# Altium schematic sheet Sheet2 (2).SchDoc
size 420 x 297 mm; Address1: Address1; Address2: Address2; Address3: Address3; Address4: Address4; DocumentNumber: АБВГ.123456.001 Э3; SheetNumber: 2; SheetTotal: 2; Scale: 1:1; DocumentType: Схема электрическая принципиальная; FirstReferrence: АБВГ.123456.001
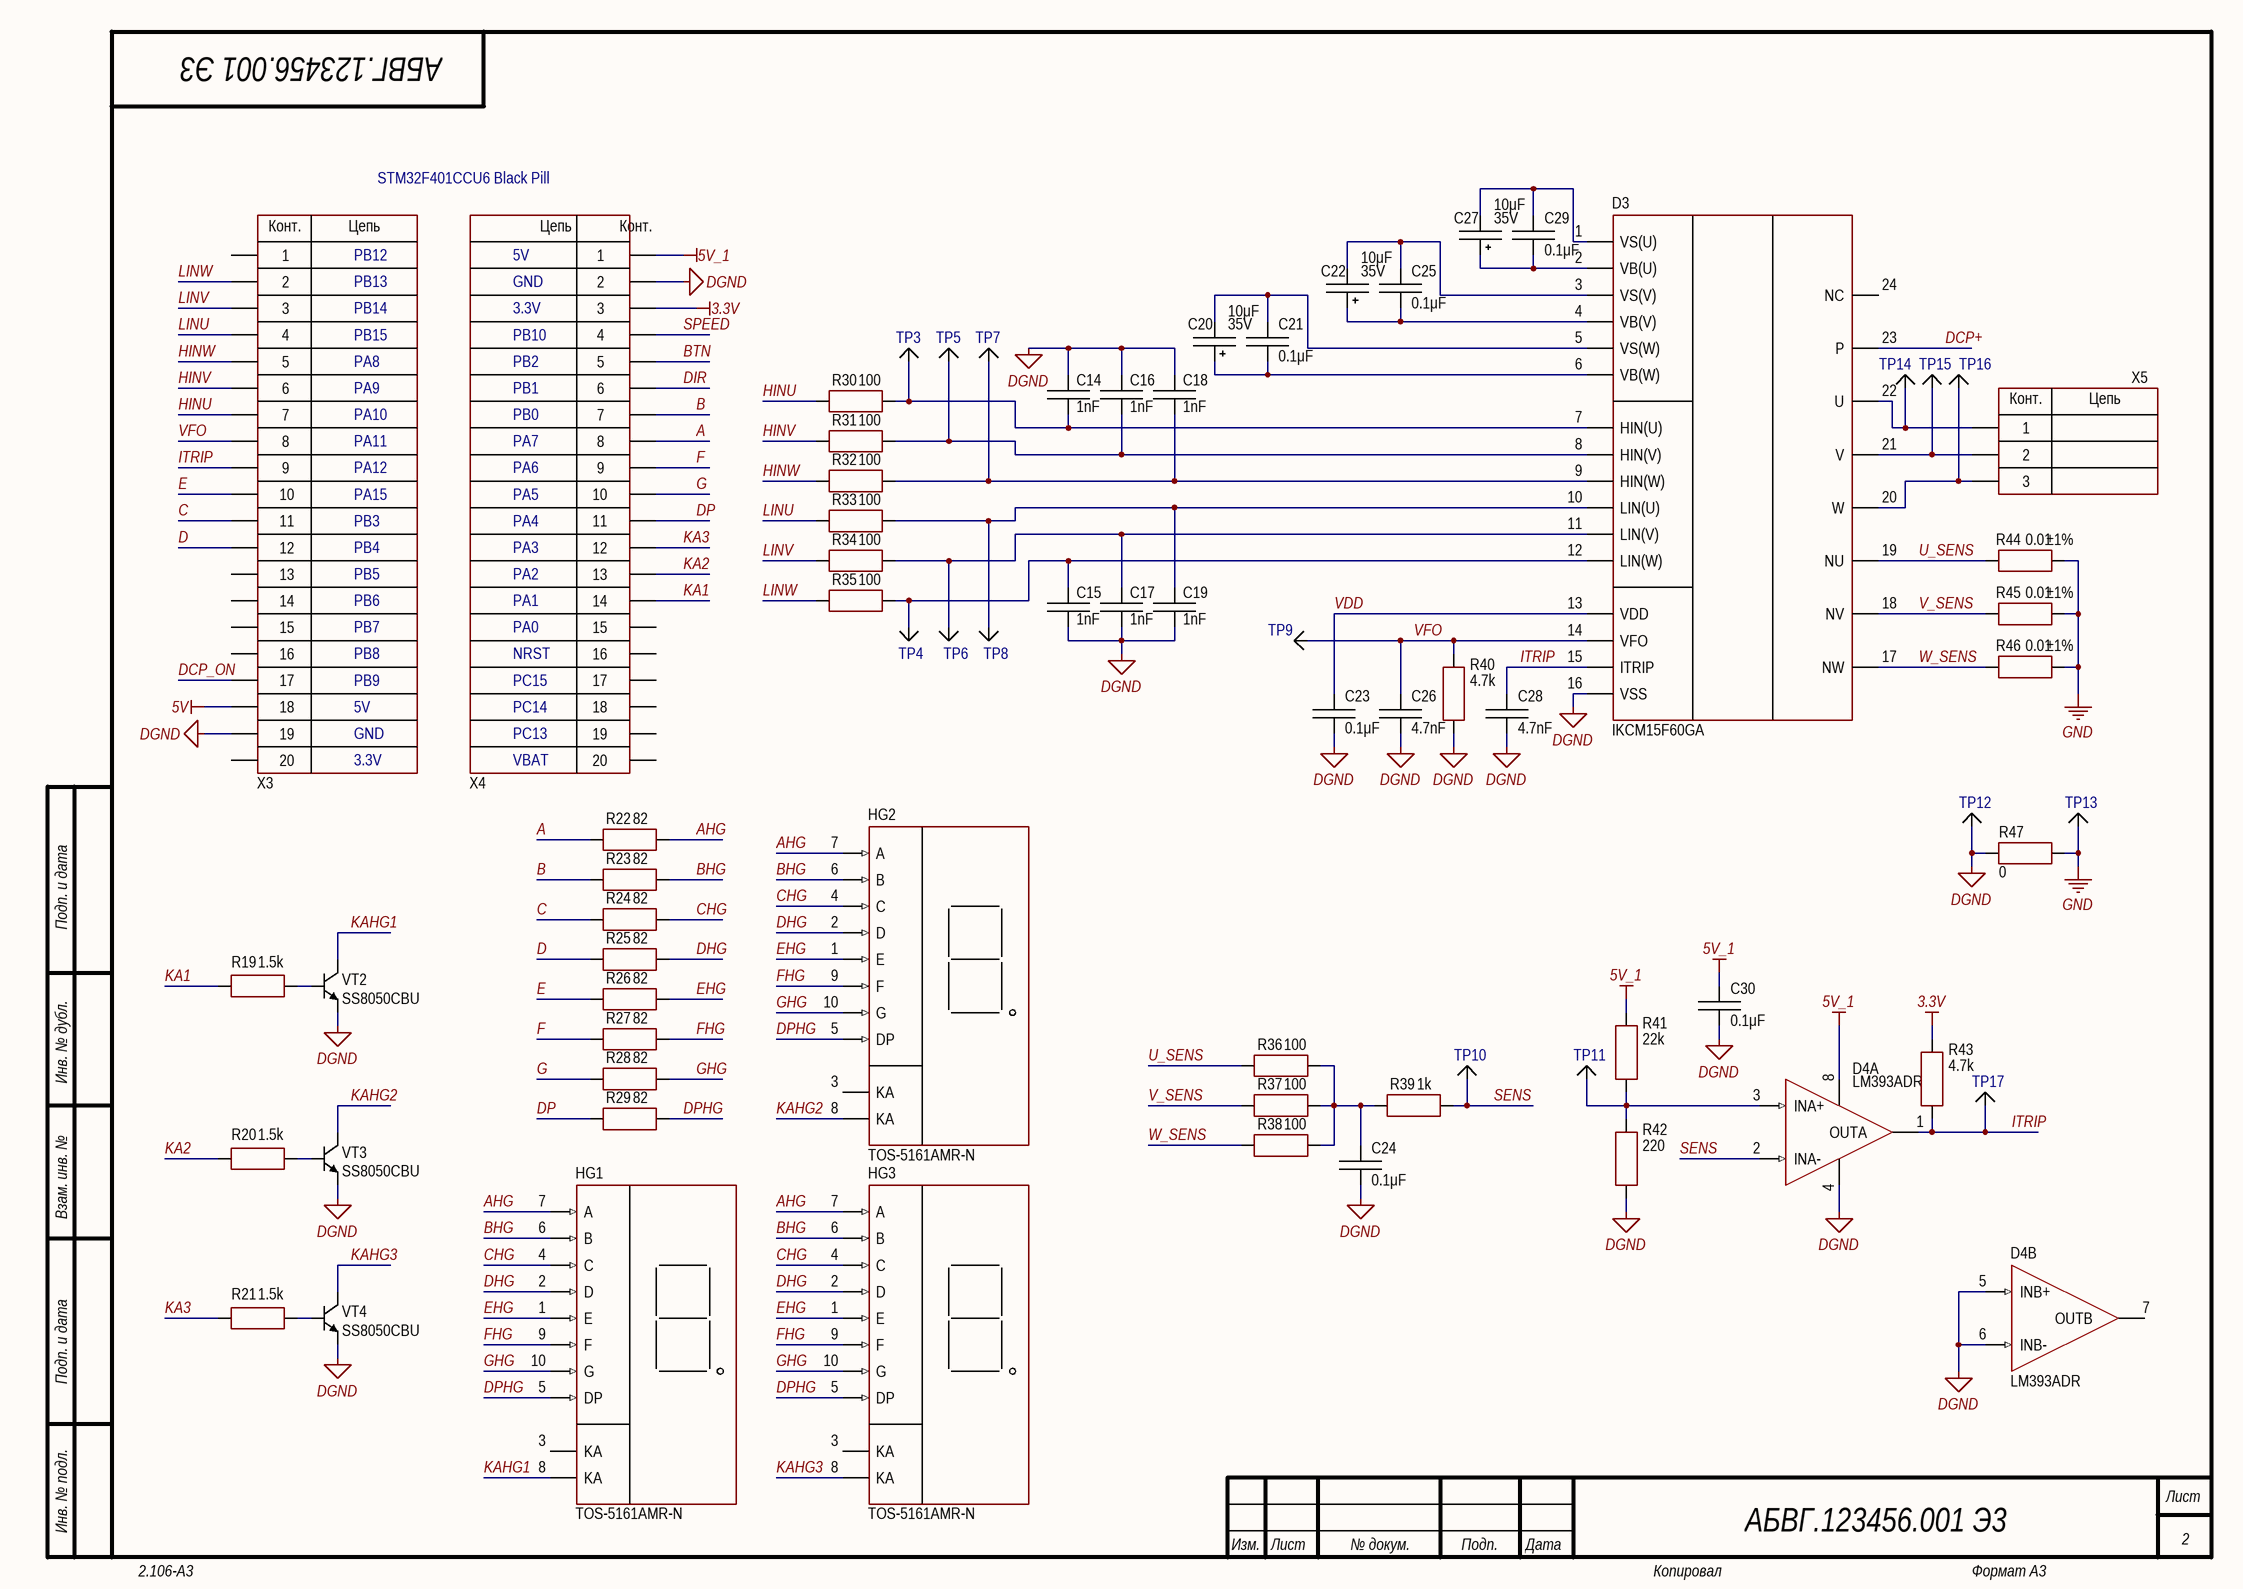
[diagram p0: Sheet2 (2).SchDoc]

## Parts
C14  value 1nF  [CAP: 1206]
C15  value 1nF  [CAP: 1206]
C16  value 1nF  [CAP: 1206]
C17  value 1nF  [CAP: 1206]
C18  value 1nF  [CAP: 1206]
C19  value 1nF  [CAP: 1206]
C20  value 10μF  Voltage: 35V  [CAP: D5C2H11]
C21  value 0.1μF  [CAP: 1206]
C22  value 10μF  Voltage: 35V  [CAP: D5C2H11]
C23  value 0.1μF  [CAP: 1206]
C24  value 0.1μF  [CAP: 1206]
C25  value 0.1μF  [CAP: 1206]
C26  value 4.7nF  [CAP: 1206]
C27  value 10μF  Voltage: 35V  [CAP: D5C2H11]
C28  value 4.7nF  [CAP: 1206]
C29  value 0.1μF  [CAP: 1206]
C30  value 0.1μF  [CAP: 1206]
D3  (no value)  [INF-CIPOS MINI]
D4  (no value)  [8-SOIC]  (parts A,B of 2)
HG1  (no value)  [TOS-5161AMR-N]
HG2  (no value)  [TOS-5161AMR-N]
HG3  (no value)  [TOS-5161AMR-N]
R19  value 1.5k  [RES: 1206]
R20  value 1.5k  [RES: 1206]
R21  value 1.5k  [RES: 1206]
R22  value 82  [RES: 1206]
R23  value 82  [RES: 1206]
R24  value 82  [RES: 1206]
R25  value 82  [RES: 1206]
R26  value 82  [RES: 1206]
R27  value 82  [RES: 1206]
R28  value 82  [RES: 1206]
R29  value 82  [RES: 1206]
R30  value 100  [RES: 1206]
R31  value 100  [RES: 1206]
R32  value 100  [RES: 1206]
R33  value 100  [RES: 1206]
R34  value 100  [RES: 1206]
R35  value 100  [RES: 1206]
R36  value 100  [RES: 1206]
R37  value 100  [RES: 1206]
R38  value 100  [RES: 1206]
R39  value 1k  [RES: 1206]
R40  value 4.7k  [RES: 1206]
R41  value 22k  [RES: 1206]
R42  value 220  [RES: 1206]
R43  value 4.7k  [RES: 1206]
R44  value 0.01  Tolerance: ±1%  [RES: 2512]
R45  value 0.01  Tolerance: ±1%  [RES: 2512]
R46  value 0.01  Tolerance: ±1%  [RES: 2512]
R47  value 0  [RES: 1206]
TP3  Test_Point  [TEST POINT KEYSTONE]  (value not drawn)
TP4  Test_Point  [TEST POINT KEYSTONE]  (value not drawn)
TP5  Test_Point  [TEST POINT KEYSTONE]  (value not drawn)
TP6  Test_Point  [TEST POINT KEYSTONE]  (value not drawn)
TP7  Test_Point  [TEST POINT KEYSTONE]  (value not drawn)
TP8  Test_Point  [TEST POINT KEYSTONE]  (value not drawn)
TP9  Test_Point  [TEST POINT KEYSTONE]  (value not drawn)
TP10  Test_Point  [TEST POINT KEYSTONE]  (value not drawn)
TP11  Test_Point  [TEST POINT KEYSTONE]  (value not drawn)
TP12  Test_Point  [TEST POINT KEYSTONE]  (value not drawn)
TP13  Test_Point  [TEST POINT KEYSTONE]  (value not drawn)
TP14  Test_Point  [TEST POINT KEYSTONE]  (value not drawn)
TP15  Test_Point  [TEST POINT KEYSTONE]  (value not drawn)
TP16  Test_Point  [TEST POINT KEYSTONE]  (value not drawn)
TP17  Test_Point  [TEST POINT KEYSTONE]  (value not drawn)
VT2  (no value)  [TO-92 - formed leads]
VT3  (no value)  [TO-92 - formed leads]
VT4  (no value)  [TO-92 - formed leads]
X3  (no value)  [PBS-20 narrow pitch]
X4  (no value)  [PBS-20 narrow pitch]
X5  (no value)  [DG128-7.5-03P]

## Nets
3.3V: R43.2 X4.3
5V: X3.18
5V_1: C30.2 D4.8(V+) R41.2 X4.1
DGND: C14.2 C15.1 C16.2 C17.1 C18.2 C19.1 C23.1 C24.1 C26.1 C28.1 C30.1 D3.16(VSS) D4.4(GND) D4.5(INB+) D4.6(INB-) R40.1 R42.1 R47.2 TP12.1 VT2.1(E) VT3.1(E) VT4.1(E) X3.19 X4.2
GND: R44.2 R45.2 R46.2 R47.1 TP13.1
A: R22.1 X4.8
AHG: HG1.7(A) HG2.7(A) HG3.7(A) R22.2
B: R23.1 X4.7
BHG: HG1.6(B) HG2.6(B) HG3.6(B) R23.2
BTN: X4.5
C: R24.1 X3.11
CHG: HG1.4(C) HG2.4(C) HG3.4(C) R24.2
D: R25.1 X3.12
DCP+: D3.23(P)
DCP_ON: X3.17
DHG: HG1.2(D) HG2.2(D) HG3.2(D) R25.2
DIR: X4.6
DP: R29.1 X4.11
DPHG: HG1.5(DP) HG2.5(DP) HG3.5(DP) R29.2
E: R26.1 X3.10
EHG: HG1.1(E) HG2.1(E) HG3.1(E) R26.2
F: R27.1 X4.9
FHG: HG1.9(F) HG2.9(F) HG3.9(F) R27.2
G: R28.1 X4.10
GHG: HG1.10(G) HG2.10(G) HG3.10(G) R28.2
HINU: R30.1 X3.7
HINV: R31.1 X3.6
HINW: R32.1 X3.5
ITRIP: C28.2 D3.15(ITRIP) D4.1(OUTA) R43.1 TP17.1 X3.9
KA1: R19.1 X4.14
KA2: R20.1 X4.13
KA3: R21.1 X4.12
KAHG1: HG1.8(KA) VT2.3(C)
KAHG2: HG2.8(KA) VT3.3(C)
KAHG3: HG3.8(KA) VT4.3(C)
LINU: R33.1 X3.4
LINV: R34.1 X3.3
LINW: R35.1 X3.2
SENS: D4.2(INA-) R39.2 TP10.1
SPEED: X4.4
U_SENS: D3.19(NU) R36.1 R44.1
V_SENS: D3.18(NV) R37.1 R45.1
VDD: C23.2 D3.13(VDD)
VFO: C26.2 D3.14(VFO) R40.2 TP9.1 X3.8
W_SENS: D3.17(NW) R38.1 R46.1
NetC14_1: C14.1 D3.7(HIN(U)) R30.2 TP3.1
NetC15_2: C15.2 D3.12(LIN(W)) R35.2 TP4.1
NetC16_1: C16.1 D3.8(HIN(V)) R31.2 TP5.1
NetC17_2: C17.2 D3.11(LIN(V)) R34.2 TP6.1
NetC18_1: C18.1 D3.9(HIN(W)) R32.2 TP7.1
NetC19_2: C19.2 D3.10(LIN(U)) R33.2 TP8.1
NetC20_1: C20.1 C21.1 D3.6(VB(W))
NetC20_2: C20.2 C21.2 D3.5(VS(W))
NetC22_1: C22.1 C25.1 D3.4(VB(V))
NetC22_2: C22.2 C25.2 D3.3(VS(V))
NetC24_2: C24.2 R36.2 R37.2 R38.2 R39.1
NetC27_1: C27.1 C29.1 D3.2(VB(U))
NetC27_2: C27.2 C29.2 D3.1(VS(U))
NetD3_20: D3.20(W) TP16.1 X5.3
NetD3_21: D3.21(V) TP15.1 X5.2
NetD3_22: D3.22(U) TP14.1 X5.1
NetD4_3: D4.3(INA+) R41.1 R42.2 TP11.1
NetR19_2: R19.2 VT2.2(B)
NetR20_2: R20.2 VT3.2(B)
NetR21_2: R21.2 VT4.2(B)

Not connected (* = marked no-connect by the designer): D3 24(NC); D4 7(OUTB); HG1 3(KA); HG2 3(KA); HG3 3(KA); X3 1 13 14 15 16 20; X4 15 16 17 18 19 20

## Notes on the sheet
- STM32F401CCU6 Black Pill
- PB12
- 5V
- PB13
- PB14
- GND
- 3.3V
- PB15
- PA8
- PA9
- PB10
- PB2
- PB1
- PA10
- PA11
- PB0
- PA7
- PA12
- PA15
- PB3
- PA6
- PA5
- PA4
- PB4
- PB5
- PA3
- PA2
- PB6
- PB7
- PB8
- PA1
- PA0
- NRST
- PB9
- PC15
- PC14
- PC13
- VBAT
- Подп. и дата
- Инв. № дубл.
- Взам. инв. №
- Инв. № подл.
- Изм.
- Лист
- № докум.
- Подп.
- Дата
- 2.106-A3
- Копировал
- Формат А3
- (in symbol DG128-7.5-03P-14) Конт.; Цепь
- (in symbol PBS-20) Конт.; Цепь

## Library data of the parts
C14-C19 = Ceramic_1206: PartNumber: Ceramic capacitor, 1nF,   50V; ValueManufacturerPartNumber: Ceramic capacitor, 1nF, X7R, ±10%, 50V, 1206, -55...+125°C; TypeCapacitor: Ceramic capacitor; Tolerance: ±10%; TypeDielectric: X7R; Voltage: 50V; Manufacturer: *; Package: 1206; HelpURL: https://www.chipdip.ru/product0/9000028006; Temperature: -55...+125°C; Price ChipDip: 8
C20 C22 C27 = Aluminium: PartNumber: 9000565842; ValueManufacturerPartNumber: Aluminium capacitor, 10μF, 35V, ±20%, 54mOhm, ?, -40...+105°C; TypeCapacitor: Aluminium capacitor; Tolerance: ±20%; Impedance: 54mOhm; Manufacturer: ?; Package: ?; HelpURL: https://www.chipdip.ru/product0/9000565850; Temperature: -40...+105°C; Price ChipDip: 9
C21 C23-C25 C29 C30 = Ceramic_1206: PartNumber: Ceramic capacitor, 0.1μF,   50V; ValueManufacturerPartNumber: Ceramic capacitor, 0.1μF, X7R, ±10%, 50V, 1206, -55...+125°C; TypeCapacitor: Ceramic capacitor; Tolerance: ±10%; TypeDielectric: X7R; Voltage: 50V; Manufacturer: *; Package: 1206; HelpURL: https://www.chipdip.ru/product0/42211; Temperature: -55...+125°C; Price ChipDip: 11
C26 C28 = Ceramic_1206: PartNumber: Ceramic capacitor, 4.7nF,   50V; ValueManufacturerPartNumber: Ceramic capacitor, 4.7nF, X7R, ±10%, 50V, 1206, -55...+125°C; TypeCapacitor: Ceramic capacitor; Tolerance: ±10%; TypeDielectric: X7R; Voltage: 50V; Manufacturer: *; Package: 1206; HelpURL: https://www.chipdip.ru/product0/470810702; Temperature: -55...+125°C; Price ChipDip: 16
D3 = IKCM15F60GA: Fully isolated Dual In-Line molded  IGBT module; Manufacturer: INFINEON TECHNOLOGIES AG.; VoltageSupply: 450V; CurrentOutput: 15A; HelpURL: https://www.infineon.com/cms/en/product/power/intelligent-power-modules-ipm/ikcm15f60ga/; Package: IKCM15F60GA; ComponentType: 600 V, 15 A three-phase intelligent power module; ValueManufacturerPartNumber: =ComponentType+', '+VoltageWork+', '+Frequency+', '+CurrentOutput+', '+CMTI+', '+VoltageSupply+', '+Temperature+', '+Package; Temperature: -40...+125°C; Price ChipDip: 3120; Price Ali: 700; PartNumber: IKCM15F60GA
D4 = LM393ADR: Low Power Low Offset Voltage Dual Comparator; Manufacturer: UTD Semiconductor Co.,Ltd; ValueManufacturerPartNumber: IC comparator, Rail-to-Rail, 2...36 V, ±1...±18 V, 0…70°C, SOP-8; Supply: 2...36 V, ±1...±18 V; OutputType: Rail-to-Rail; Propagation Delay: 1.3u; Art: 9001105966; HelpURL: https://www.chipdip.ru/product0/9001105966?from=suggest_product; Package: SOP-8; ComponentType: IC comparator; Temperature: 0…70°C; PartNumber: LM393ADR; Price ChipDip: 7
HG1-HG3 = TOS-5161AMR-N: Single Digit Display LED; Manufacturer: Taiwan Oasis Technology Co., Ltd; Forward Voltage: 2V; Art: 32257; HelpURL: https://www.chipdip.ru/product/tos-5161amr-n; Package: TOS-5161AMR-N; ComponentType: Single Digit Display LED; ValueManufacturerPartNumber: =ComponentType+', '+Supply+', '+Temperature+', '+Package; Temperature: -25...+85°C; Price ChipDip: 53; PartNumber: TOS-5161AMR-N
R19-R21 = Resistor_1206: Manufacturer: Yageo; PartNumber: RC1206JR-07100RL; ValueManufacturerPartNumber: Resistor film, 1.5k, ±5%, 1206, 0.25W, -55...+125°C; TypeResistor: Resistor film; Power: 0.25W; Tolerance: ±5%; Package: 1206; HelpURL: https://www.digikey.com/product-detail/en/yageo/RC1206JR-07100RL/311-100ERCT-ND/732153; Temperature: -55...+125°C
R22-R29 = Resistor_1206: Manufacturer: Yageo; PartNumber: RC1206JR-07100RL; ValueManufacturerPartNumber: Resistor film, 82, ±5%, 1206, 0.25W, -55...+125°C; TypeResistor: Resistor film; Power: 0.25W; Tolerance: ±5%; Package: 1206; HelpURL: https://www.digikey.com/product-detail/en/yageo/RC1206JR-07100RL/311-100ERCT-ND/732153; Temperature: -55...+125°C
R30-R38 = Resistor_1206: Manufacturer: Yageo; PartNumber: RC1206JR-07100RL; ValueManufacturerPartNumber: Resistor film, 100, ±5%, 1206, 0.25W, -55...+125°C; TypeResistor: Resistor film; Power: 0.25W; Tolerance: ±5%; Package: 1206; HelpURL: https://www.digikey.com/product-detail/en/yageo/RC1206JR-07100RL/311-100ERCT-ND/732153; Temperature: -55...+125°C
R39 = Resistor_1206: Manufacturer: Yageo; PartNumber: RC1206JR-07100RL; ValueManufacturerPartNumber: Resistor film, 1k, ±5%, 1206, 0.25W, -55...+125°C; TypeResistor: Resistor film; Power: 0.25W; Tolerance: ±5%; Package: 1206; HelpURL: https://www.digikey.com/product-detail/en/yageo/RC1206JR-07100RL/311-100ERCT-ND/732153; Temperature: -55...+125°C
R40 R43 = Resistor_1206: Manufacturer: Yageo; PartNumber: RC1206JR-07100RL; ValueManufacturerPartNumber: Resistor film, 4.7k, ±5%, 1206, 0.25W, -55...+125°C; TypeResistor: Resistor film; Power: 0.25W; Tolerance: ±5%; Package: 1206; HelpURL: https://www.digikey.com/product-detail/en/yageo/RC1206JR-07100RL/311-100ERCT-ND/732153; Temperature: -55...+125°C
R41 = Resistor_1206: Manufacturer: Yageo; PartNumber: RC1206JR-07100RL; ValueManufacturerPartNumber: Resistor film, 22k, ±5%, 1206, 0.25W, -55...+125°C; TypeResistor: Resistor film; Power: 0.25W; Tolerance: ±5%; Package: 1206; HelpURL: https://www.digikey.com/product-detail/en/yageo/RC1206JR-07100RL/311-100ERCT-ND/732153; Temperature: -55...+125°C
R42 = Resistor_1206: Manufacturer: Yageo; PartNumber: RC1206JR-07100RL; ValueManufacturerPartNumber: Resistor film, 220, ±5%, 1206, 0.25W, -55...+125°C; TypeResistor: Resistor film; Power: 0.25W; Tolerance: ±5%; Package: 1206; HelpURL: https://www.digikey.com/product-detail/en/yageo/RC1206JR-07100RL/311-100ERCT-ND/732153; Temperature: -55...+125°C
R44-R46 = Resistor_2512: Manufacturer: UNI-ROYAL(Uniroyal Elec); PartNumber: 25121WF100MT4E; ValueManufacturerPartNumber: Resistor film, 0.01, ±1%, 2512, 1W, -55...+125°C; TypeResistor: Resistor film; Power: 1W; Package: 2512; HelpURL: https://static.chipdip.ru/lib/922/DOC012922563.pdf; Temperature: -55...+125°C; Price DKO: 10
R47 = Resistor_1206: Manufacturer: Yageo; PartNumber: RC1206JR-07100RL; ValueManufacturerPartNumber: Resistor film, 0, ±5%, 1206, 0.25W, -55...+125°C; TypeResistor: Resistor film; Power: 0.25W; Tolerance: ±5%; Package: 1206; HelpURL: https://www.digikey.com/product-detail/en/yageo/RC1206JR-07100RL/311-100ERCT-ND/732153; Temperature: -55...+125°C
VT2-VT4 = SS8050CBU: Manufacturer: ON Semiconductor; ValueManufacturerPartNumber: NPN transistor, 40V, 1.5A, 190MHz, 1W, 0.5Vmax, 120...200, TO-92, 150°C; TypeTransistor: NPN transistor; VoltageCE: 40V; CurrentCE: 1.5A; VoltageSaturation: 0.5Vmax; Frequency: 190MHz; CurrentGain: 120...200; MaxPower: 1W; Art: 32257; Package: TO-92; HelpURL: https://www.chipdip.ru/product/s8050; Temperature: 150°C; Price ChipDip: 19; PartNumber: SS8050CBU
X3 X4 = PBS-20: Manufacturer: Connfly; ValueManufacturerPartNumber: Connector, 20pin, 2.54mm, 500VAC, 3A; TypeConnector: Connector; VoltageMax: 500VAC; Pitch: 2.54mm; CurrentMax: 3A; Multichannel: 20pin; CommentText: "Разъем"; HelpURL: https://www.chipdip.ru/product/pbd-20; PartNumber: PBS-20
X5 = DG128-7.5-03P-14: Manufacturer: Degson Electronics; ValueManufacturerPartNumber: Connector, 3pin, 9.53mm, 300VAC, 16A; TypeConnector: Connector; VoltageMax: 300VAC; Pitch: 9.53mm; CurrentMax: 16A; Multichannel: 3pin; CommentText: "Разъем"; Art: 8007163542; HelpURL: https://www.chipdip.ru/product0/8007163542; PartNumber: DG128-7.5-03P-14; Price ChipDip: 37